# Altium schematic sheet 4th_Order_Linwitz-Riley_Low_Pass_Filter.SchDoc
size A4; SheetNumber: 8; SheetTotal: 10
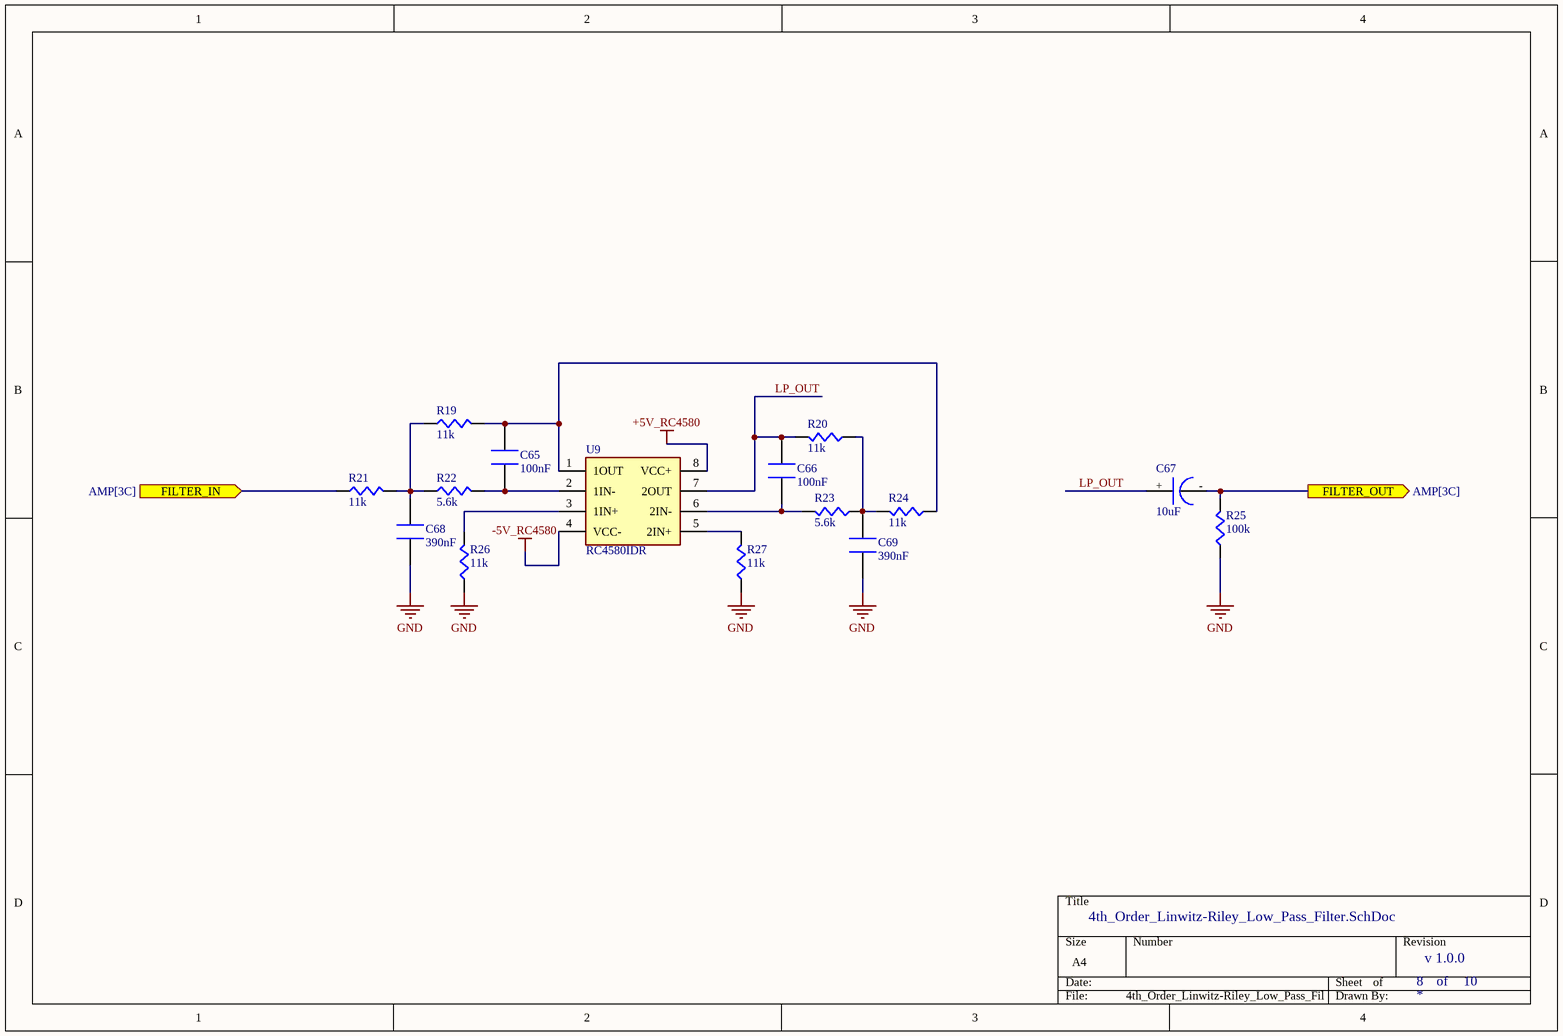
[diagram p0: 4th_Order_Linwitz-Riley_Low_Pass_Filter.SchDoc]

## Parts
C65  100nF  [CAPC1206X18N]
C66  100nF  [CAPC1206X18N]
C67  10uF  [CAPD6.3XL5.8X61M]
C68  390nF  [CAPC0805X14N]
C69  390nF  [CAPC0805X14N]
R19  11k  [RECS0603X45N]
R20  11k  [RECS0603X45N]
R21  11k  [RECS0603X45N]
R22  5.6k  [RECS0603X45N]
R23  5.6k  [RECS0603X45N]
R24  11k  [RECS0603X45N]
R25  100k  [RECS0603X45N]
R26  11k  [RECS0603X45N]
R27  11k  [RECS0603X45N]
U9  RC4580IDR  [SOIC127P600X175-8N]

## Ports
FILTER_IN (in, see AMP[3C]), FILTER_OUT (out, see AMP[3C])

## Nets
+5V_RC4580: U9.8(VCC+)
-5V_RC4580: U9.4(VCC-)
GND: C68.1 C69.2 R25.1 R26.1 R27.1
FILTER_IN: R21.1 ; port FILTER_IN
FILTER_OUT: C67.2 R25.2 ; port FILTER_OUT
LP_OUT: C66.1 C67.1 R20.2 U9.7(2OUT)
NetC65_1: C65.1 R22.2 U9.2(1IN-)
NetC65_2: C65.2 R19.2 R24.1 U9.1(1OUT)
NetC66_2: C66.2 R23.2 U9.6(2IN-)
NetC68_2: C68.2 R19.1 R21.2 R22.1
NetC69_1: C69.1 R20.1 R23.1 R24.2
NetR26_2: R26.2 U9.3(1IN+)
NetR27_2: R27.2 U9.5(2IN+)

## Notes on the sheet
- v 1.0.0
- of
- (in symbol CPD6.3XL5.8_10uF_POLYMER) +; -

## Library data of the parts
C65 C66 = CC1206_100nF_C0G: C97946, GRM31C5C1H104JA01L, 100nF 50V C0G ±5% 1206 Multilayer Ceramic Capacitors MLCC - SMD/SMT ROHS; Supplier 1: TME; Supplier Part Number 1: GRM31C5C1H104JA01L
C67 = CPD6.3XL5.8_10uF_POLYMER: C5246550, HV1V106M0605PZ, -55℃~+105℃ 10uF 2.2mm 2000hrs 35V 5.8mm 6.3mm ±20% SMD,D6.3xL5.8mm Polymer Aluminum Capacitors ROHS; Supplier 1: LCSC; Supplier Part Number 1: C5246550
C68 C69 = CC0805_390nF_X7R: C1854267, CC0805KKX7R9BB394, 390nF 50V X7R ±10% 0805 Multilayer Ceramic Capacitors MLCC - SMD/SMT ROHS; Supplier 1: element14 APAC; Supplier Part Number 1: CC0805KKX7R9BB394
R19-R21 R24 R26 R27 = RESC0603_11K_THIN: C728581, RT0603BRD0711KL, -55℃~+155℃ 100mW 11kΩ 75V Thin Film Resistor ±0.1% ±25ppm/℃ 0603 Chip Resistor - Surface Mount ROHS; Supplier 1: element14 APAC; Supplier Part Number 1: 4152637
R22 R23 = RESC0603_5.6K_THIN: C179095, RT0603BRD075K6L, -55℃~+155℃ 100mW 5.6kΩ 75V Thin Film Resistor ±0.1% ±25ppm/℃ 0603 Chip Resistor - Surface Mount ROHS; Supplier 1: element14 APAC; Supplier Part Number 1: 3496658
R25 = RESC0603_100K_THIN: C116674, AC0603FR-07100KL, -55℃~+155℃ 100kΩ 100mW 75V Thick Film Resistor ±1% ±100ppm/℃ 0603 Chip Resistor - Surface Mount ROHS; Supplier 1: element14 APAC; Supplier Part Number 1: AC0603FR-07100KL
U9 = RC4580IDR: C80100, RC4580IDR, -16V~-2V、2V~16V -40℃~+85℃ 0.0005% 110dB 2-Channel 9mA SOIC-8 Audio Amplifiers ROHS; Manufacturer_Name: Texas Instruments; Datasheet Link: http://www.ti.com/lit/gpn/rc4580; Height: 1.75mm; Manufacturer_Part_Number: RC4580IDR; Mouser Part Number: 595-RC4580IDR; Mouser Price/Stock: https://www.mouser.co.uk/ProductDetail/Texas-Instruments/RC4580IDR?qs=sSOk4GDDv7xt5SOlVrtkww%3D%3D; Arrow Part Number: RC4580IDR; Arrow Price/Stock: https://www.arrow.com/en/products/rc4580idr/texas-instruments?region=nac; Supplier 1: Rochester Electronics; Supplier Part Number 1: RC4580IDR